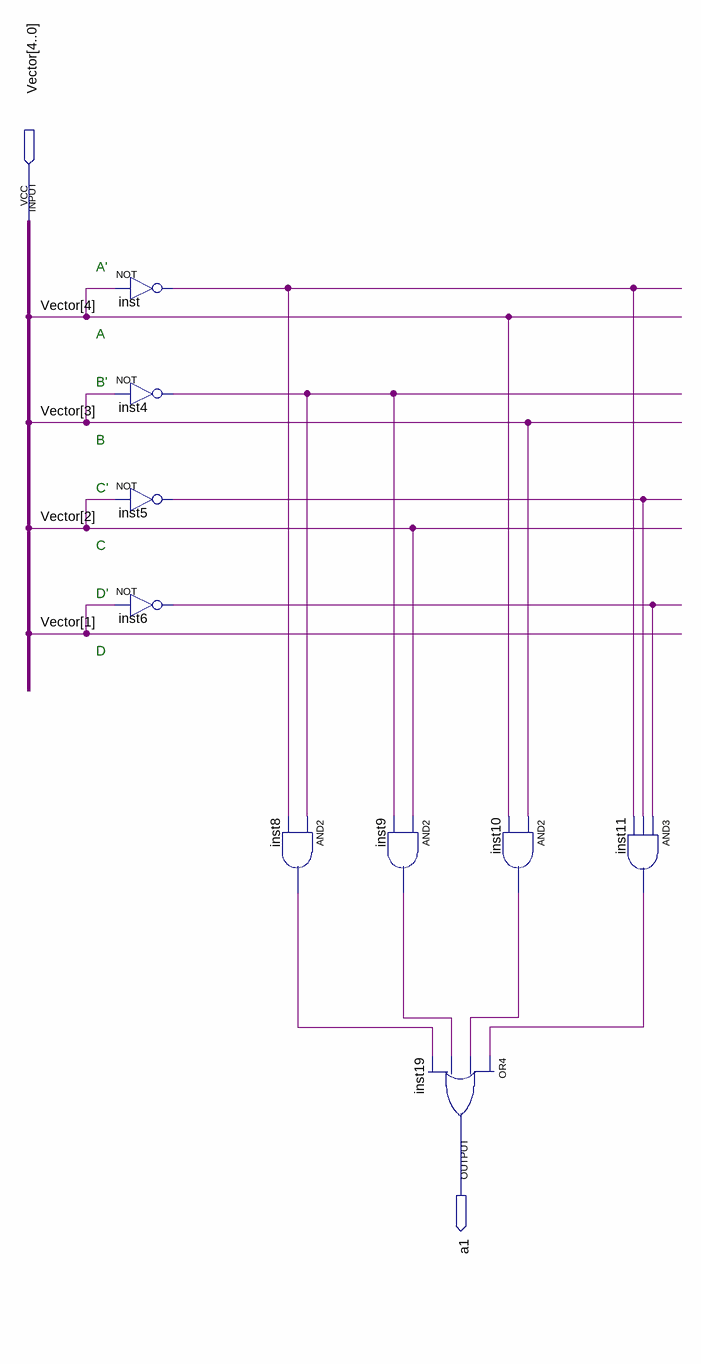
[diagram p0: schematic sheet]
// Quartus schematic a1.bdf as structural Verilog: 9 symbols, 2 pins
module a1 (
  input  [4:0] Vector,
  output a1
);

  wire inst4_out, inst5_out, inst6_out, inst8_out, inst9_out, inst10_out, inst11_out, inst_out;

  not inst (inst_out, Vector[4]);
  not inst4 (inst4_out, Vector[3]);
  not inst5 (inst5_out, Vector[2]);
  not inst6 (inst6_out, Vector[1]);
  and inst8 (inst8_out, inst4_out, inst_out);
  and inst9 (inst9_out, Vector[2], inst4_out);
  or inst19 (a1, inst11_out, inst10_out, inst9_out, inst8_out);
  and inst10 (inst10_out, Vector[3], Vector[4]);
  and inst11 (inst11_out, inst6_out, inst5_out, inst_out);

  // Notes on the sheet:
  //   A'
  //   A
  //   B'
  //   B
  //   C'
  //   C
  //   D'
  //   D
endmodule
